# EAGLE schematic schemat_sterownik_dachu_R129_wersjaD09_Dr_03 (EAGLE 7.5.0)
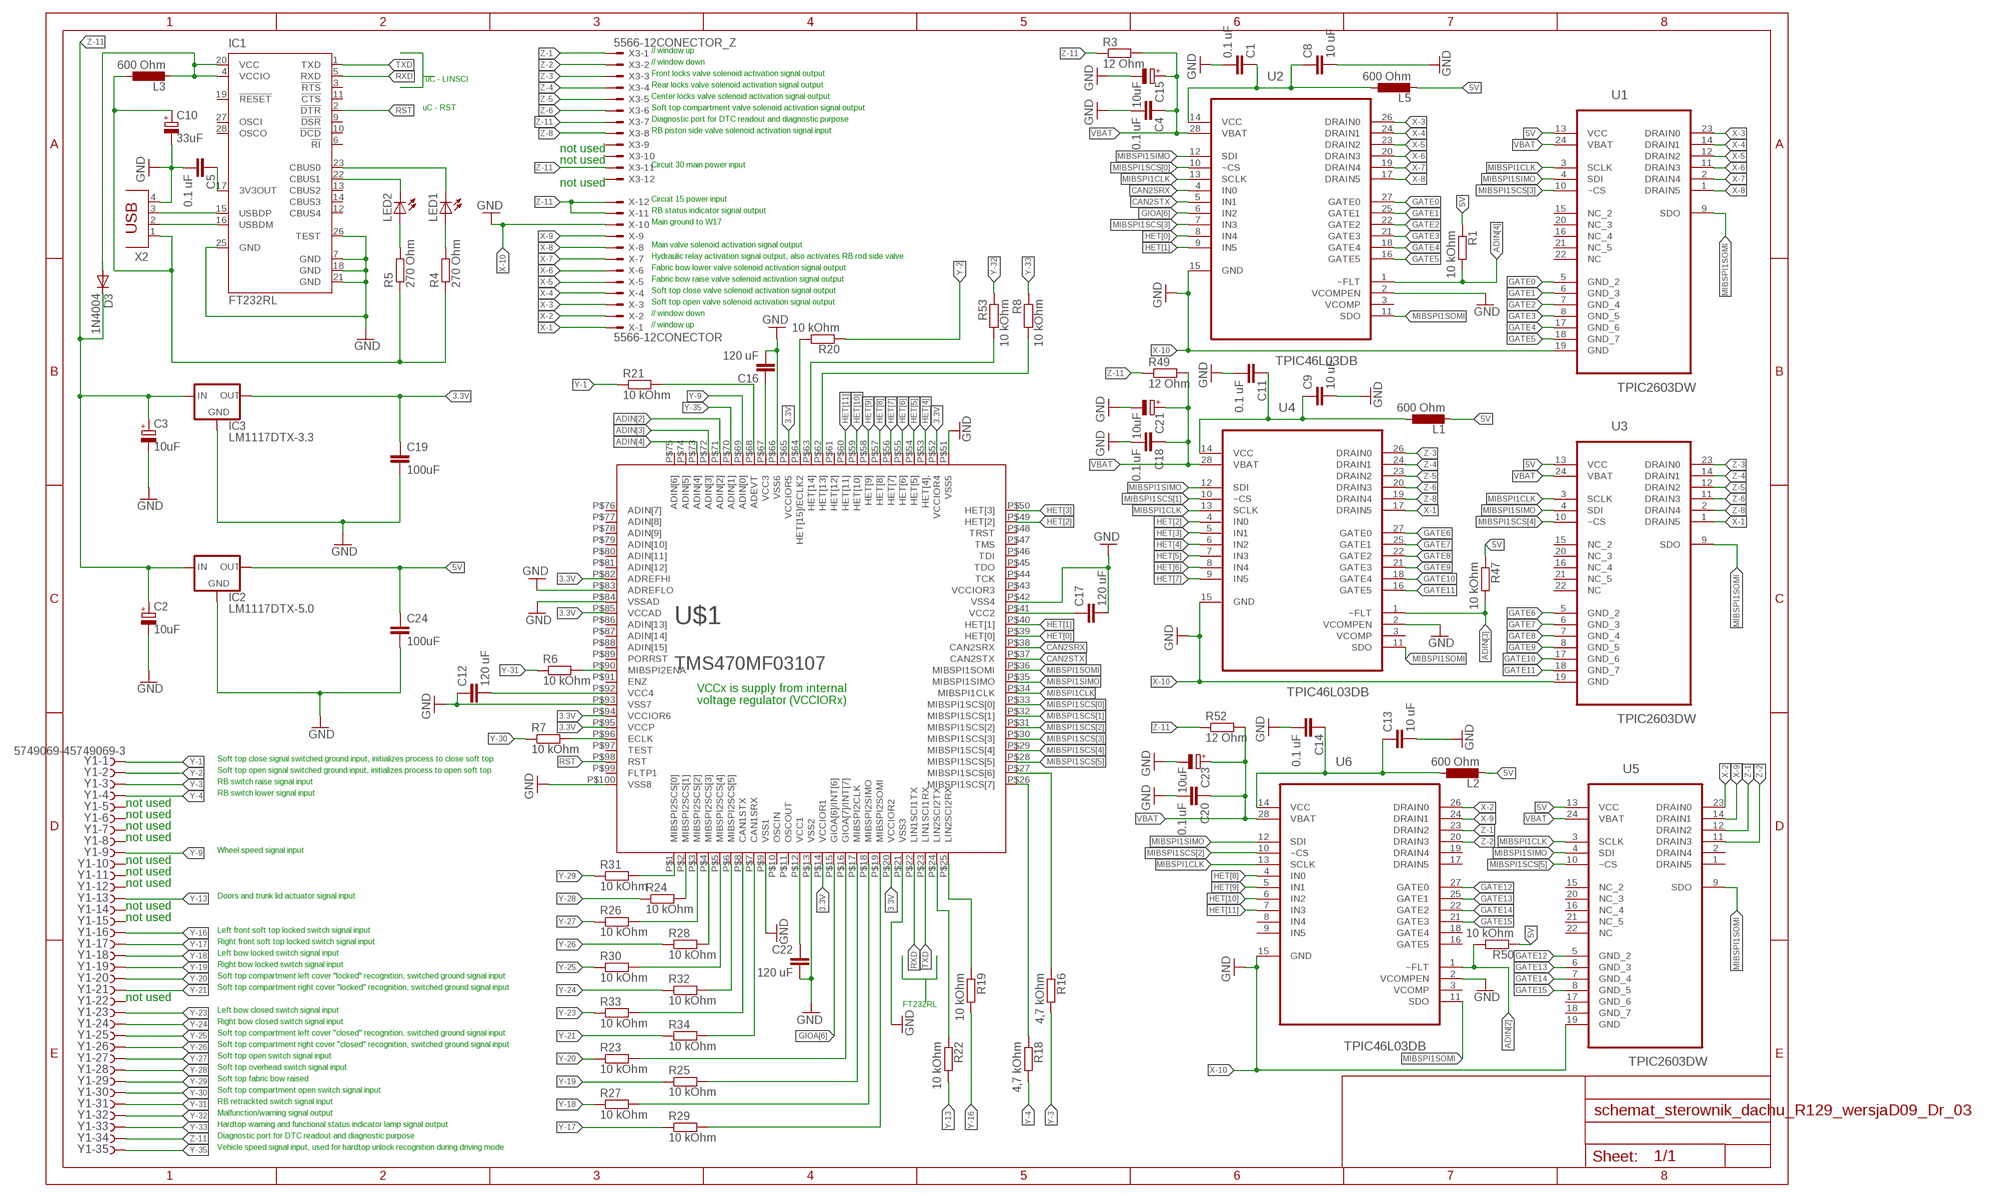
[diagram p0: schematic, sheet 1]

## Parts
C1  0.1 uF  C-EUC0805  [C0805]
C2  10uF  CPOL-EUSMCC  [SMC_C]
C3  10uF  CPOL-EUSMCC  [SMC_C]
C4  0.1 uF  C-EUC0805  [C0805]
C5  0.1 uF  C-EUC0805  [C0805]
C8  10 uF  C-EUC0805  [C0805]
C9  10 uF  C-EUC0805  [C0805]
C10  33uF  CPOL-EUSMCC  [SMC_C]
C11  0.1 uF  C-EUC0805  [C0805]
C12  120 uF  C-EUC3225  [C3225]
C13  10 uF  C-EUC0805  [C0805]
C14  0.1 uF  C-EUC0805  [C0805]
C15  10uF  CPOL-EUSMCC  [SMC_C]
C16  120 uF  C-EUC3225  [C3225]
C17  120 uF  C-EUC3225  [C3225]
C18  0.1 uF  C-EUC0805  [C0805]
C19  100uF  C-EUC1210  [C1210]
C20  0.1 uF  C-EUC0805  [C0805]
C21  10uF  CPOL-EUSMCC  [SMC_C]
C22  120 uF  C-EUC3225  [C3225]
C23  10uF  CPOL-EUSMCC  [SMC_C]
C24  100uF  C-EUC1210  [C1210]
D3  1N4004  [DO41-10]
IC1  FT232RL  [SSOP28]
IC2  LM1117DTX-5.0  [TO252]
IC3  LM1117DTX-3.3  [TO252]
L1  600 Ohm  L-EUL3216C  [L3216C]
L2  600 Ohm  L-EUL3216C  [L3216C]
L3  600 Ohm  L-EUL3216C  [L3216C]
L5  600 Ohm  L-EUL3216C  [L3216C]
LED1  LEDCHIPLED_1206  [CHIPLED_1206]
LED2  LEDCHIPLED_1206  [CHIPLED_1206]
R1  10 kOhm  R-EU_R0603  [R0603]
R3  12 Ohm  R-EU_R0603  [R0603]
R4  270 Ohm  R-EU_R0603  [R0603]
R5  270 Ohm  R-EU_R0603  [R0603]
R6  10 kOhm  R-EU_R0603  [R0603]
R7  10 kOhm  R-EU_R0603  [R0603]
R8  10 kOhm  R-EU_R0603  [R0603]
R16  4,7 kOhm  R-EU_R0603  [R0603]
R18  4,7 kOhm  R-EU_R0603  [R0603]
R19  10 kOhm  R-EU_R0603  [R0603]
R20  10 kOhm  R-EU_R0603  [R0603]
R21  10 kOhm  R-EU_R0603  [R0603]
R22  10 kOhm  R-EU_R0603  [R0603]
R23  10 kOhm  R-EU_R0603  [R0603]
R24  10 kOhm  R-EU_R0603  [R0603]
R25  10 kOhm  R-EU_R0603  [R0603]
R26  10 kOhm  R-EU_R0603  [R0603]
R27  10 kOhm  R-EU_R0603  [R0603]
R28  10 kOhm  R-EU_R0603  [R0603]
R29  10 kOhm  R-EU_R0603  [R0603]
R30  10 kOhm  R-EU_R0603  [R0603]
R31  10 kOhm  R-EU_R0603  [R0603]
R32  10 kOhm  R-EU_R0603  [R0603]
R33  10 kOhm  R-EU_R0603  [R0603]
R34  10 kOhm  R-EU_R0603  [R0603]
R47  10 kOhm  R-EU_R0603  [R0603]
R49  12 Ohm  R-EU_R0603  [R0603]
R50  10 kOhm  R-EU_R0603  [R0603]
R52  12 Ohm  R-EU_R0603  [R0603]
R53  10 kOhm  R-EU_R0603  [R0603]
U1  TPIC2603DW  [SOIC127P1030X265-24N]
U2  TPIC46L03DB  [SOP65P780X200-28N]
U3  TPIC2603DW  [SOIC127P1030X265-24N]
U4  TPIC46L03DB  [SOP65P780X200-28N]
U5  TPIC2603DW  [SOIC127P1030X265-24N]
U6  TPIC46L03DB  [SOP65P780X200-28N]
U$1  TMS470MF03107  [S-PQFP-G100]
X  5566-12CONECTOR  [5566-12]
X2  PN61729  [PN61729]
X3  5566-12CONECTOR_Z  [5566-12]
Y1  5749069-45749069-3  [5749069-4]

## Nets
3.3V: C19.1 IC3.TAB(OUT) U$1.P$14(VCCIOR1) U$1.P$20(VCCIOR2) U$1.P$52(VCCIOR4) U$1.P$65(VCCIOR5) U$1.P$82(ADREFHI) U$1.P$85(VCCAD) U$1.P$94(VCCIOR6) U$1.P$95(VCCP)
5V: C24.1 D3.A IC1.4(VCCIO) IC1.20(VCC) IC2.TAB(OUT) L1.2 L2.2 L3.2 L5.2 R1.1 R47.1 R50.1 U1.13(VCC) U3.13(VCC) U5.13(VCC)
ADIN[2]: R50.2 U6.1(~FLT) U$1.P$71(ADIN[2])
ADIN[3]: R47.2 U4.1(~FLT) U$1.P$72(ADIN[3])
ADIN[4]: R1.2 U2.1(~FLT) U$1.P$73(ADIN[4])
CAN2SRX: U2.4(IN0) U$1.P$38(CAN2SRX)
CAN2STX: U2.5(IN1) U$1.P$37(CAN2STX)
GATE0: U1.5(GND_2) U2.27(GATE0)
GATE1: U1.6(GND_3) U2.25(GATE1)
GATE2: U1.7(GND_4) U2.22(GATE2)
GATE3: U1.8(GND_5) U2.21(GATE3)
GATE4: U1.17(GND_6) U2.18(GATE4)
GATE5: U1.18(GND_7) U2.16(GATE5)
GATE6: U3.5(GND_2) U4.27(GATE0)
GATE7: U3.6(GND_3) U4.25(GATE1)
GATE8: U3.7(GND_4) U4.22(GATE2)
GATE9: U3.8(GND_5) U4.21(GATE3)
GATE10: U3.17(GND_6) U4.18(GATE4)
GATE11: U3.18(GND_7) U4.16(GATE5)
GATE12: U5.5(GND_2) U6.27(GATE0)
GATE13: U5.6(GND_3) U6.25(GATE1)
GATE14: U5.7(GND_4) U6.22(GATE2)
GATE15: U5.8(GND_5) U6.21(GATE3)
GIOA[6]: U2.6(IN2) U$1.P$15(GIOA[6]/INT[6])
GND: C1.2 C2.- C3.- C4.2 C5.2 C8.2 C9.2 C10.- C11.2 C12.1 C13.2 C14.2 C15.- C16.2 C17.2 C18.2 C19.2 C20.2 C21.- C22.2 C23.- C24.2 IC1.7(GND) IC1.18(GND) IC1.21(GND) IC1.25(GND) IC1.26(TEST) IC2.1(GND) IC3.1(GND) U2.2(VCOMPEN) U4.2(VCOMPEN) U6.2(VCOMPEN) U$1.P$9(VSS1) U$1.P$13(VSS2) U$1.P$21(VSS3) U$1.P$42(VSS4) U$1.P$51(VSS5) U$1.P$66(VSS6) U$1.P$83(ADREFLO) U$1.P$84(VSSAD) U$1.P$93(VSS7) U$1.P$100(VSS8) X2.4
HET[0]: U2.8(IN4) U$1.P$39(HET[0])
HET[1]: U2.9(IN5) U$1.P$40(HET[1])
HET[2]: U4.4(IN0) U$1.P$49(HET[2])
HET[3]: U4.5(IN1) U$1.P$50(HET[3])
HET[4]: U4.6(IN2) U$1.P$53(HET[4],)
HET[5]: U4.7(IN3) U$1.P$54(HET[5])
HET[6]: U4.8(IN4) U$1.P$55(HET[6])
HET[7]: U4.9(IN5) U$1.P$56(HET[7])
HET[8]: U6.4(IN0) U$1.P$57(HET[8])
HET[9]: U6.5(IN1) U$1.P$58(HET[9])
HET[10]: U6.6(IN2) U$1.P$59(HET[10])
HET[11]: U6.7(IN3) U$1.P$60(HET[11])
HET[13]: R8.2 U$1.P$62(HET[13])
HET[14]: R53.2 U$1.P$63(HET[14])
MIBSPI1CLK: U1.3(SCLK) U2.13(SCLK) U3.3(SCLK) U4.13(SCLK) U5.3(SCLK) U6.13(SCLK) U$1.P$34(MIBSPI1CLK)
MIBSPI1SCS[0]: U2.10(~CS) U$1.P$33(MIBSPI1SCS[0])
MIBSPI1SCS[1]: U4.10(~CS) U$1.P$32(MIBSPI1SCS[1])
MIBSPI1SCS[2]: U6.10(~CS) U$1.P$31(MIBSPI1SCS[2])
MIBSPI1SCS[3]: U1.10(~CS) U2.7(IN3) U$1.P$30(MIBSPI1SCS[3])
MIBSPI1SCS[4]: U3.10(~CS) U$1.P$29(MIBSPI1SCS[4])
MIBSPI1SCS[5]: U5.10(~CS) U$1.P$28(MIBSPI1SCS[5])
MIBSPI1SIMO: U1.4(SDI) U2.12(SDI) U3.4(SDI) U4.12(SDI) U5.4(SDI) U6.12(SDI) U$1.P$35(MIBSPI1SIMO)
MIBSPI1SOMI: U1.9(SDO) U2.11(SDO) U3.9(SDO) U4.11(SDO) U5.9(SDO) U6.11(SDO) U$1.P$36(MIBSPI1SOMI)
N$1: R7.2 U$1.P$96(ECLK)
N$4: C16.1 U$1.P$67(VCC3)
N$5: C17.1 U$1.P$41(VCC2)
N$7: R6.2 U$1.P$90(MIBSPI2ENA)
N$8: R26.2 U$1.P$3(MIBSPI2SCS[2])
N$9: R20.2 U$1.P$64(HET[15]/ECLK2)
N$10: R21.2 U$1.P$68(ADEVT)
N$11: R18.1 U$1.P$26(MIBSPI1SCS[7])
N$13: C5.1 IC1.17(3V3OUT)
N$14: IC1.22(CBUS1) LED2.C
N$15: C22.1 U$1.P$12(VCC1)
N$16: C12.2 U$1.P$92(VCC4)
N$21: IC1.16(USBDM) X2.2
N$22: IC1.15(USBDP) X2.3
N$26: IC1.23(CBUS0) LED1.C
N$27: C1.1 C8.1 L5.1 U2.14(VCC)
N$28: LED1.A R4.2
N$29: LED2.A R5.2
N$36: R16.1 U$1.P$27(MIBSPI1SCS[6])
N$65: R23.2 U$1.P$16(GIOA[7]/INT[7])
N$68: R25.2 U$1.P$17(MIBSPI2CLK)
N$71: R27.2 U$1.P$18(MIBSPI2SIMO)
N$73: R29.2 U$1.P$19(MIBSPI2SOMI)
N$78: R22.1 U$1.P$24(LIN2SCI2TX)
N$79: R19.1 U$1.P$25(LIN2SCI2RX)
N$86: R34.2 U$1.P$7(CAN1SRX)
N$87: R33.2 U$1.P$8(CAN1STX)
N$88: R32.2 U$1.P$6(MIBSPI2SCS[5])
N$89: R30.2 U$1.P$5(MIBSPI2SCS[4])
N$90: R28.2 U$1.P$4(MIBSPI2SCS[3])
N$92: R24.2 U$1.P$2(MIBSPI2SCS[1])
N$93: R31.2 U$1.P$1(MIBSPI2SCS[0])
N$114: C9.1 C11.1 L1.1 U4.14(VCC)
N$133: C13.1 C14.1 L2.1 U6.14(VCC)
RST: IC1.2(!DTR) U$1.P$98(RST)
RXD: IC1.5(RXD) U$1.P$22(LIN1SCI1TX)
TXD: IC1.1(TXD) U$1.P$23(LIN1SCI1RX)
VBAT: C4.1 C15.+ C18.1 C20.1 C21.+ C23.+ R3.2 R49.2 R52.2 U1.24(VBAT) U2.28(VBAT) U3.24(VBAT) U4.28(VBAT) U5.24(VBAT) U6.28(VBAT)
VCC: C10.+ L3.1 R4.1 R5.1 X2.1
X-1: U3.1(DRAIN5) U4.17(DRAIN5) X.1
X-2: U5.23(DRAIN0) U6.26(DRAIN0) X.2
X-3: U1.23(DRAIN0) U2.26(DRAIN0) X.3
X-4: U1.14(DRAIN1) U2.24(DRAIN1) X.4
X-5: U1.12(DRAIN2) U2.23(DRAIN2) X.5
X-6: U1.11(DRAIN3) U2.20(DRAIN3) X.6
X-7: U1.2(DRAIN4) U2.19(DRAIN4) X.7
X-8: U1.1(DRAIN5) U2.17(DRAIN5) X.8
X-9: U5.14(DRAIN1) U6.24(DRAIN1) X.9
X-10: U1.19(GND) U2.15(GND) U3.19(GND) U4.15(GND) U5.19(GND) U6.15(GND) X.10 ; supply symbol labelled GND
Y-1: R21.1 Y1.1
Y-2: R20.1 Y1.2
Y-3: R16.2 Y1.3
Y-4: R18.2 Y1.4
Y-9: U$1.P$69(ADIN[0]) Y1.9
Y-13: R22.2 Y1.13
Y-16: R19.2 Y1.16
Y-17: R29.1 Y1.17
Y-18: R27.1 Y1.18
Y-19: R25.1 Y1.19
Y-20: R23.1 Y1.20
Y-21: R34.1 Y1.21
Y-23: R33.1 Y1.23
Y-24: R32.1 Y1.24
Y-25: R30.1 Y1.25
Y-26: R28.1 Y1.26
Y-27: R26.1 Y1.27
Y-28: R24.1 Y1.28
Y-29: R31.1 Y1.29
Y-30: R7.1 Y1.30
Y-31: R6.1 Y1.31
Y-32: R53.1 Y1.32
Y-33: R8.1 Y1.33
Y-35: U$1.P$70(ADIN[1]) Y1.35
Z-1: U5.12(DRAIN2) U6.23(DRAIN2) X3.1
Z-2: U5.11(DRAIN3) U6.20(DRAIN3) X3.2
Z-3: U3.23(DRAIN0) U4.26(DRAIN0) X3.3
Z-4: U3.14(DRAIN1) U4.24(DRAIN1) X3.4
Z-5: U3.12(DRAIN2) U4.23(DRAIN2) X3.5
Z-6: U3.11(DRAIN3) U4.20(DRAIN3) X3.6
Z-8: U3.2(DRAIN4) U4.19(DRAIN4) X3.8
Z-11: C2.+ C3.+ D3.C IC2.2(IN) IC3.2(IN) R3.1 R49.1 R52.1 X3.7 X3.11 X.11 X.12 Y1.34
Unconnected: IC1.3(!RTS) IC1.6(!RI) IC1.9(!DSR) IC1.10(!DCD) IC1.11(!CTS) IC1.12(CBUS4) IC1.13(CBUS2) IC1.14(CBUS3) IC1.19(!RESET) IC1.27(OSCI) IC1.28(OSCO) U1.15(NC_2) U1.16(NC_4) U1.20(NC_3) U1.21(NC_5) U1.22(NC) U2.3(VCOMP) U3.15(NC_2) U3.16(NC_4) U3.20(NC_3) U3.21(NC_5) U3.22(NC) U4.3(VCOMP) U5.1(DRAIN5) U5.2(DRAIN4) U5.15(NC_2) U5.16(NC_4) U5.17(GND_6) U5.18(GND_7) U5.20(NC_3) U5.21(NC_5) U5.22(NC) U6.3(VCOMP) U6.8(IN4) U6.9(IN5) U6.16(GATE5) U6.17(DRAIN5) U6.18(GATE4) U6.19(DRAIN4) U$1.P$10(OSCIN) U$1.P$11(OSCOUT) U$1.P$43(VCCIOR3) U$1.P$44(TCK) U$1.P$45(TDO) U$1.P$46(TDI) U$1.P$47(TMS) U$1.P$48(TRST) U$1.P$61(HET[12]) U$1.P$74(ADIN[5]) U$1.P$75(ADIN[6]) U$1.P$76(ADIN[7]) U$1.P$77(ADIN[8]) U$1.P$78(ADIN[9]) U$1.P$79(ADIN[10]) U$1.P$80(ADIN[11]) U$1.P$81(ADIN[12]) U$1.P$86(ADIN[13]) U$1.P$87(ADIN[14]) U$1.P$88(ADIN[15]) U$1.P$89(PORRST) U$1.P$91(ENZ) U$1.P$97(TEST) U$1.P$99(FLTP1) X3.9 X3.10 X3.12 Y1.5 Y1.6 Y1.7 Y1.8 Y1.10 Y1.11 Y1.12 Y1.14 Y1.15 Y1.22

## Notes on the sheet
- // window up
- // window down
- uC - LINSCI | Front locks valve solenoid activation signal output
- Rear locks valve solenoid activation signal output
- Center locks valve solenoid activation signal output
- uC - RST | Soft top compartment valve solenoid activation signal output
- Diagnostic port for DTC readout and diagnostic purpose
- RB piston side valve solenoid activation signal input
- not used
- not used
- Circuit 30 main power input
- not used
- Circuit 15 power input
- RB status indicator signal output
- Main ground to W17
- Main valve solenoid activation signal output
- Hydraulic relay activation signal output, also activates RB rod side valve
- Fabric bow lower valve solenoid activation signal output
- Fabric bow raise valve solenoid activation signal output
- Soft top close valve solenoid activation signal output
- Soft top open valve solenoid activation signal output
- // window down
- // window up
- VCCx is supply from internal 
  voltage regulator (VCCIORx)
- Soft top close signal switched ground input, initializes process to close soft top
- Soft top open signal switched ground input, initializes process to open soft top
- RB switch raise signal input
- RB switch lower signal input
- not used
- not used
- not used
- not used
- Wheel speed signal input
- not used
- not used
- not used
- Doors and trunk lid actuator signal input
- not used
- not used
- Left front soft top locked switch signal input
- Right front soft top locked switch signal input
- Left bow locked switch signal input
- Right bow locked switch signal input
- Soft top compartment left cover "locked" recognition, switched ground signal input
- Soft top compartment right cover "locked" recognition, switched ground signal input
- not used | FT232RL
- Left bow closed switch signal input
- Right bow closed switch signal input
- Soft top compartment left cover "closed" recognition, switched ground signal input
- Soft top compartment right cover "closed" recognition, switched ground signal input
- Soft top open switch signal input
- Soft top overhead switch signal input
- Soft top fabric bow raised
- Soft top compartment open switch signal input
- RB retrackted switch signal input
- Malfunction/warning signal output
- Hardtop warning and functional status indicator lamp signal output
- Diagnostic port for DTC readout and diagnostic purpose
- Vehicle speed signal input, used for hardtop unlock recognition during driving mode

## Library data of the parts
C1 C4 C5 C8 C9 C11 C13 C14 C18 C20 = resistor:C-EU: CAPACITOR, European symbol
C2 C3 C10 C15 C21 C23 = rcl:CPOL-EU: POLARIZED CAPACITOR, European symbol
C12 C16 C17 C19 C22 C24 = rcl:C-EU: CAPACITOR, European symbol
D3 = diode:1N4004: DIODE general purpose rectifier, 1 A
IC1 = ftdichip:FT232R: Source: http://www.ftdichip.com/Documents/DataSheets/DS_FT232R_v104.pdf; MPN: FT232RL; OC_FARNELL: 1146032; OC_NEWARK: 91K9918
IC2 IC3 = lm1117:LM1117DTX-*
L1-L3 L5 = rcl:L-EU: INDUCTOR, European symbol
LED1 LED2 = led:LED: LED OSRAM: - CHIPLED LG R971, LG N971, LY N971, LG Q971, LY Q971, LO R971, LY R971 LH N974, LH R974 LS Q976, LO Q976, LY Q976 LO Q996 - Hyper CHIPLED LW Q18S LB Q993, LB Q99A, LB R99A - SideLED LS A670, LO A670, LY A670, LG A670, LP A670 LB A673, LV A673, LT A673, LW A673 LH A674 LY A675 LS A676, LA A676, LO A676, LY A676, LW A676 LS A679, LY A679, LG A679 - Hyper Micro SIDELED® LS Y876, LA Y876, LO Y876, LY Y876 LT Y87S - SmartLED LW L88C, LW L88S LB L89C, LB L89S, LG L890 LS L89K, LO L89K, LY L89K LS L896, LA L896, LO L896, LY L896 - TOPLED LS T670, LO T670, LY T670, LG T670, LP T670 LSG T670, LSP T670, LSY T670, LOP T670, LYG T670 LG T671, LOG T671, LSG T671 LB T673, LV T673, LT T673, LW T673 LH T674 LS T676, LA T676, LO T676, LY T676, LB T676, LH T676, LSB T676, LW T676 LB T67C, LV T67C, LT T67C, LS T67K, LO T67K, LY T67K, LW E67C LS E67B, LA E67B, LO E67B, LY E67B, LB E67C, LV E67C, LT E67C LW T67C LS T679, LY T679, LG T679 LS T770, LO T770, LY T770, LG T770, LP T770 LB T773, LV T773, LT T773, LW T773 LH T774 LS E675, LA E675, LY E675, LS T675 LS T776, LA T776, LO T776, LY T776, LB T776 LHGB T686 LT T68C, LB T68C - Hyper Mini TOPLED® LB M676 - Mini TOPLED Santana® LG M470 LS M47K, LO M47K, LY M47K Source: http://www.osram.convergy.de LUXEON: - LUMILED® LXK2-PW12-R00, LXK2-PW12-S00, LXK2-PW14-U00, LXK2-PW14-V00 LXK2-PM12-R00, LXK2-PM12-S00, LXK2-PM14-U00 LXK2-PE12-Q00, LXK2-PE12-R00, LXK2-PE12-S00, LXK2-PE14-T00, LXK2-PE14-U00 LXK2-PB12-K00, LXK2-PB12-L00, LXK2-PB12-M00, LXK2-PB14-N00, LXK2-PB14-P00, LXK2-PB14-Q00 LXK2-PR12-L00, LXK2-PR12-M00, LXK2-PR14-Q00, LXK2-PR14-R00 LXK2-PD12-Q00, LXK2-PD12-R00, LXK2-PD12-S00 LXK2-PH12-R00, LXK2-PH12-S00 LXK2-PL12-P00, LXK2-PL12-Q00, LXK2-PL12-R00 Source: www.luxeon.com KINGBRIGHT: KA-3528ASYC Source: www.kingbright.com
R1 R3-R8 R16 R18-R34 R47 R49 R50 R52 R53 = resistor:R-EU_: RESISTOR, European symbol
U1 U3 U5 = Texas Instruments_By_element14_Batch_1:TPIC2603DW: 6-Channel serial Interface low side driver; MPN: TPIC2603DW; OC_FARNELL: 1461108; OC_NEWARK: 76C9890; PACKAGE: SOIC-24; SUPPLIER: Texas Instruments
U2 U4 U6 = Texas Instruments_By_element14_Batch_1:TPIC46L03DB: 6-Channel Serial-In/Parallel-In Low-side Pre-FET Driver; MPN: TPIC46L03DB; OC_FARNELL: -; OC_NEWARK: 51P2627; PACKAGE: SSOP-28; SUPPLIER: Texas Instruments
U$1 = TI_project:TMS470MF03107
X = con-molex:5566-12: Mini FIT connector 12 pol Source: http://www.molex.com
X2 = con-berg:PN61729: BERG USB connector; OC_FARNELL: unknown; OC_NEWARK: unknown
X3 = con-molex3:5566-12: Mini FIT connector 12 pol Source: http://www.molex.com
Y1 = con-amp-te3:5749069-4: TE CONNECTIVITY / AMP - BUCHSE, SCSI, VERTIKAL, 40 Source: Data sheet <http://www.tycoelectronics.com/commerce/DocumentDelivery/DDEController?Action=srchrtrv&DocNm=5749069&DocType=Customer+Drawing&DocLang=English>

## Net classes
0 default: clearance 0.205 mm